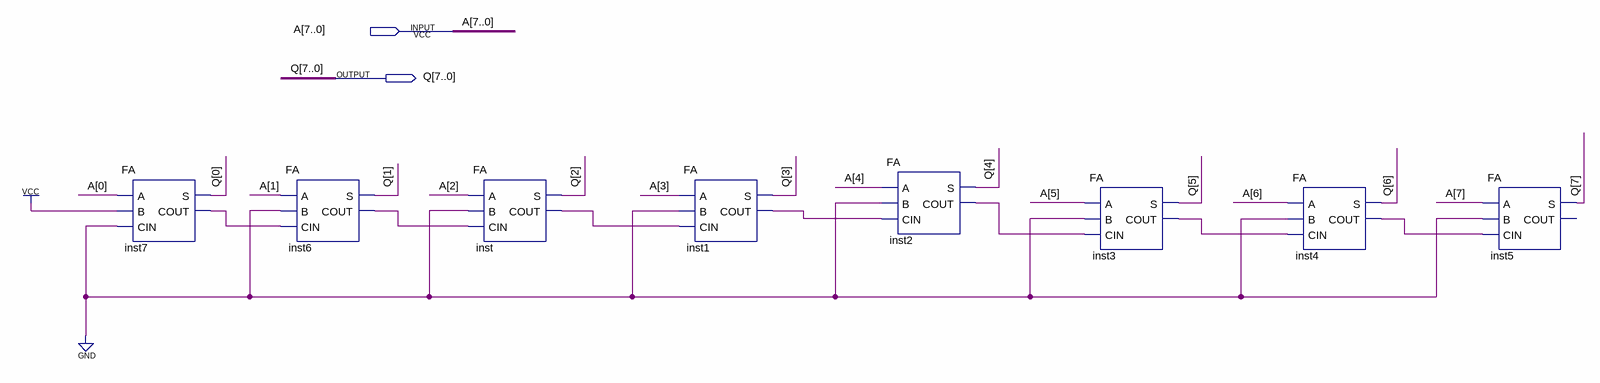
[diagram p0: schematic sheet]
// Quartus schematic CONG_1.bdf as structural Verilog: 8 symbols, 2 pins
module CONG_1 (
  input  [7:0] A,
  output [7:0] Q
);

  wire inst1_cout, inst2_cout, inst3_cout, inst4_cout, inst6_cout, inst7_cout, inst_cout;

  FA inst7 (.A(A[0]), .B(1'b1), .CIN(1'b0), .S(Q[0]), .COUT(inst7_cout));
  FA inst6 (.A(A[1]), .B(1'b0), .CIN(inst7_cout), .S(Q[1]), .COUT(inst6_cout));
  FA inst (.A(A[2]), .B(1'b0), .CIN(inst6_cout), .S(Q[2]), .COUT(inst_cout));
  FA inst1 (.A(A[3]), .B(1'b0), .CIN(inst_cout), .S(Q[3]), .COUT(inst1_cout));
  FA inst2 (.A(A[4]), .B(1'b0), .CIN(inst1_cout), .S(Q[4]), .COUT(inst2_cout));
  FA inst3 (.A(A[5]), .B(1'b0), .CIN(inst2_cout), .S(Q[5]), .COUT(inst3_cout));
  FA inst4 (.A(A[6]), .B(1'b0), .CIN(inst3_cout), .S(Q[6]), .COUT(inst4_cout));
  FA inst5 (.A(A[7]), .B(1'b0), .CIN(inst4_cout), .S(Q[7]));  // open: COUT
endmodule
